# Altium schematic sheet STM32 FillLab WalkThrough.SchDoc
size 420 x 297 mm; SheetNumber: 1; SheetTotal: 1
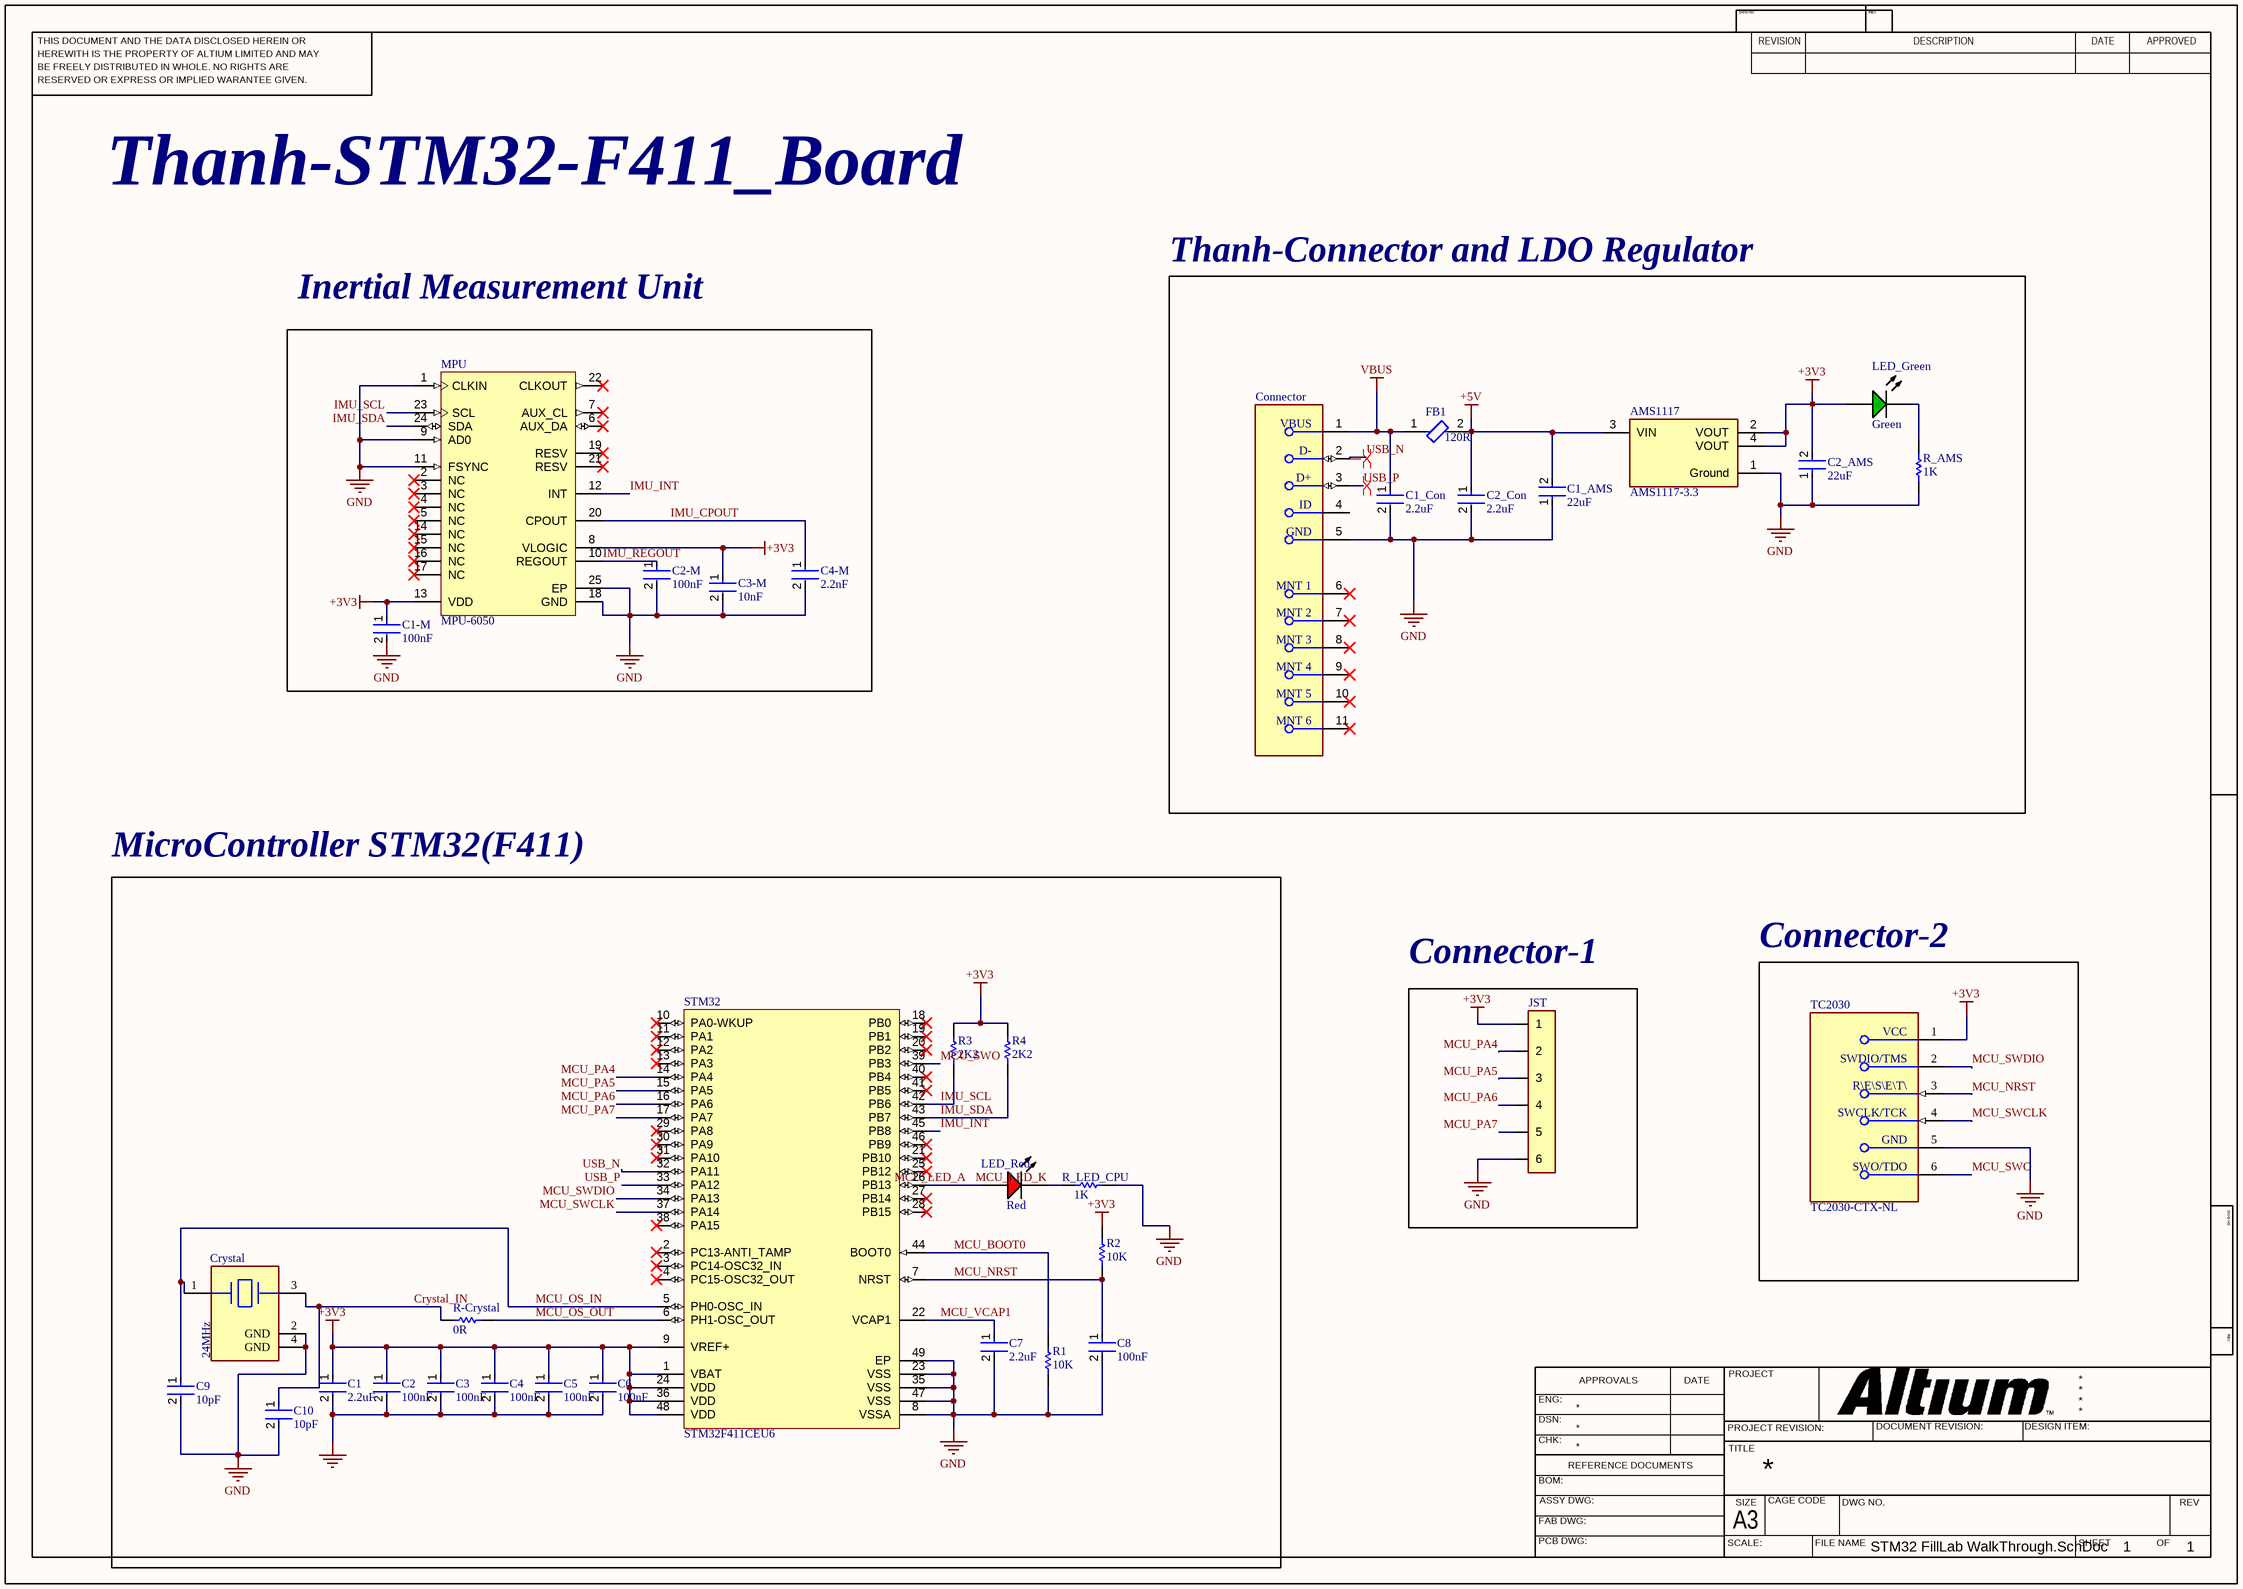
[diagram p0: STM32 FillLab WalkThrough.SchDoc]

## Parts
AMS1117  AMS1117-3.3  [FP-AMS1117-IPC_C]
C1  2.2uF  [FP-C0402-BB-MFG]
C1-M  100nF  [FP-C0402-BB-MFG]
C1_AMS  22uF  [FP-C0402-BB-MFG]
C1_Con  2.2uF  [FP-C0402-BB-MFG]
C2  100nF  [FP-C0402-BB-MFG]
C2-M  100nF  [FP-C0402-BB-MFG]
C2_AMS  22uF  [FP-C0402-BB-MFG]
C2_Con  2.2uF  [FP-C0402-BB-MFG]
C3  100nF  [FP-C0402-BB-MFG]
C3-M  10nF  [FP-C0402-BB-MFG]
C4  100nF  [FP-C0402-BB-MFG]
C4-M  2.2nF  [FP-C0402-BB-MFG]
C5  100nF  [FP-C0402-BB-MFG]
C6  100nF  [FP-C0402-BB-MFG]
C7  2.2uF  [FP-C0402-BB-MFG]
C8  100nF  [FP-C0402-BB-MFG]
C9  10pF  [FP-C0402-BB-MFG]
C10  10pF  [FP-C0402-BB-MFG]
Connector  473460001  [FP-473460001-MFG]  (value not drawn)
Crystal  24MHz  [FP-ABM8-MFG]
FB1  120R  [FP-BLM15-0_05-IPC_B]
JST  SM06B-GHS-TB  [JST-GH-6]  (value not drawn)
LED_Green  Green  [AVAG-HSMX-C170_V]
LED_Red  Red  [AVAG-HSMX-C150_V]
MPU  MPU-6050  [IS-QFN-24_V]
R1  10K  [RESC1609X50X30NL8T20]
R2  10K  [RESC1609X50X30NL8T20]
R3  2K2  [RESC1609X50X30NL8T20]
R4  2K2  [RESC1609X50X30NL8T20]
R-Crystal  0R  [RESC1609X50X30NL8T20]
R_AMS  1K  [RESC1609X50X30NL8T20]
R_LED_CPU  1K  [RESC1609X50X30NL8T20]
STM32  STM32F411CEU6  [STM-UFQFPN48_L]
TC2030  TC2030-CTX-NL  [FP-TC2030-CTX-NL-MFG]

## Blocks framed on the sheet
Thanh-Connector and LDO Regulator: AMS1117 C1_AMS C1_Con C2_AMS C2_Con Connector FB1 LED_Green R_AMS
MicroController STM32(F411): C1-C10 Crystal LED_Red R1-R4 R-Crystal R_LED_CPU STM32
Connector-2: TC2030
Connector-1: JST

## Nets
+3V3: AMS1117.2(VOUT) AMS1117.4(VOUT) C1.1 C1-M.1 C2.1 C2_AMS.2 C3.1 C3-M.1 C4.1 C5.1 C6.1 JST.P$1(1) LED_Green.1(A) MPU.8(VLOGIC) MPU.13(VDD) R2.2 R3.2 R4.2 STM32.1(VBAT) STM32.9(VREF+) STM32.24(VDD) STM32.36(VDD) STM32.48(VDD) TC2030.1(VCC)
+5V: AMS1117.3(VIN) C1_AMS.2 C2_Con.1 FB1.2
GND: AMS1117.1(Ground) C1.2 C1-M.2 C1_AMS.1 C1_Con.2 C2.2 C2-M.2 C2_AMS.1 C2_Con.2 C3.2 C3-M.2 C4.2 C4-M.2 C5.2 C6.2 C7.2 C8.2 C9.2 C10.2 Connector.5(GND) Crystal.2(GND) Crystal.4(GND) JST.P$6(6) MPU.1(CLKIN) MPU.9(AD0) MPU.11(FSYNC) MPU.18(GND) MPU.25(EP) R1.1 R_AMS.1 R_LED_CPU.1 STM32.8(VSSA) STM32.23(VSS) STM32.35(VSS) STM32.47(VSS) STM32.49(EP) TC2030.5(GND)
VBUS: C1_Con.1 Connector.1(VBUS) FB1.1
Crystal_IN: C10.1 Crystal.3 R-Crystal.2
IMU_CPOUT: C4-M.1 MPU.20(CPOUT)
IMU_INT: MPU.12(INT) STM32.45(PB8)
IMU_REGOUT: C2-M.1 MPU.10(REGOUT)
IMU_SCL: MPU.23(SCL) R3.1 STM32.42(PB6)
IMU_SDA: MPU.24(SDA) R4.1 STM32.43(PB7)
MCU_BOOT0: R1.2 STM32.44(BOOT0)
MCU_LED_A: LED_Red.1(A) STM32.26(PB13)
MCU_LED_K: LED_Red.2(K) R_LED_CPU.2
MCU_NRST: C8.1 R2.1 STM32.7(NRST) TC2030.3(~{RESET})
MCU_OS_IN: C9.1 Crystal.1 STM32.5(PH0-OSC_IN)
MCU_OS_OUT: R-Crystal.1 STM32.6(PH1-OSC_OUT)
MCU_PA4: JST.P$2(2) STM32.14(PA4)
MCU_PA5: JST.P$3(3) STM32.15(PA5)
MCU_PA6: JST.P$4(4) STM32.16(PA6)
MCU_PA7: JST.P$5(5) STM32.17(PA7)
MCU_SWCLK: STM32.37(PA14) TC2030.4(SWCLK/TCK)
MCU_SWDIO: STM32.34(PA13) TC2030.2(SWDIO/TMS)
MCU_SWO: STM32.39(PB3) TC2030.6(SWO/TDO)
MCU_VCAP1: C7.1 STM32.22(VCAP1)
USB_N: Connector.2(D-) STM32.32(PA11)
USB_P: Connector.3(D+) STM32.33(PA12)
NetLED_Green_2: LED_Green.2(K) R_AMS.2

Not connected (* = marked no-connect by the designer): Connector 4(ID) 6(MNT_1)* 7(MNT_2)* 8(MNT_3)* 9(MNT_4)* 10(MNT_5)* 11(MNT_6)*; MPU 2(NC)* 3(NC)* 4(NC)* 5(NC)* 6(AUX_DA)* 7(AUX_CL)* 14(NC)* 15(NC)* 16(NC)* 17(NC)* 19(RESV)* 21(RESV)* 22(CLKOUT)*; STM32 2(PC13-ANTI_TAMP)* 3(PC14-OSC32_IN)* 4(PC15-OSC32_OUT)* 10(PA0-WKUP)* 11(PA1)* 12(PA2)* 13(PA3)* 18(PB0)* 19(PB1)* 20(PB2)* 21(PB10)* 25(PB12)* 27(PB14)* 28(PB15)* 29(PA8)* 30(PA9)* 31(PA10)* 38(PA15)* 40(PB4)* 41(PB5)* 46(PB9)*

## Layout directives
differential pair: USB_N, USB_P

## Notes on the sheet
- Thanh-STM32-F411_Board
- Inertial Measurement Unit
- THIS DOCUMENT AND THE DATA DISCLOSED HEREIN OR
- HEREWITH IS THE PROPERTY OF ALTIUM LIMITED AND MAY
- DWG NO:
- REVISION
- REV:
- DESCRIPTION
- DATE
- APPROVED
- BE FREELY DISTRIBUTED IN WHOLE. NO RIGHTS ARE
- RESERVED OR EXPRESS OR IMPLIED WARANTEE GIVEN.
- ENG:
- APPROVALS
- PROJECT
- DSN:
- CHK:
- REFERENCE DOCUMENTS
- PROJECT REVISION:
- TITLE
- DOCUMENT REVISION:
- DESIGN ITEM:
- BOM:
- FAB DWG:
- PCB DWG:
- ASSY DWG:
- SCALE:
- A3
- SIZE
- CAGE CODE
- FILE NAME
- DWG NO.
- SHEET
- OF
- REV

## Library data of the parts
AMS1117 = CMP-209535-000001-1: LDO Voltage Regulators 1A, 3.3V; Manufacturer: Advanced Monolithic Systems; Dropout Voltage: 1.1V; Output Type: Fixed; Nominal Supply Current: 5mA; Max Power Dissipation: 1.2W; Max Supply Voltage: 15V; Number Of Outputs: 1; Standoff Height: 0.64mm; Max Junction Temp: +125°C; Height: 1.8mm; Package: AMS1117; Device Class L2: Power Management ICs; ComponentLink2Description: Datasheet; ComponentLink2URL: http://www.advanced-monolithic.com/pdf/ds1117.pdf; Category: IC; RoHS: TRUE; Automotive: No; Device Class L1: Integrated Circuits (ICs); Output Current: 1A; Device Class L3: Voltage Regulators - Linear; Temperature: -40°C to +125°C; Output Voltage: 3.3V; Manufacturer Part Number: AMS1117-3.3; Temperature Range Low: -40°C; Octopart: https://octopart.com/ams1117-3.3-advanced+monolithic+systems-25899300; Lead Free: Yes; Ipc Land Pattern Name: SOT229P700X180-4; Temperature Range High: +125°C
C1 C1-M C1_AMS C1_Con C2 C2-M C2_AMS C2_Con C3 C3-M C4 C4-M C5-C10 = CMP-2008-02046-2: CAP CER 0.1UF 10V X5R 0402; Manufacturer: Kemet; Manufacturer Part Number: C0402C104K8PACTU; Material: Ceramic; Capacitance: 0.10 μF; Temperature Coefficient: 15%; Tolerance: 0.1; Value: 0.10 μF; Package: C0402-BB; Temperature: -55°C to +125°C; ComponentLink2Description: Datasheet; Temperature Characteristic: X5R; Device Class L1: Passive Components; Height: 0.55mm; Lead Free: Yes; ComponentLink2URL: https://content.kemet.com/datasheets/KEM_C1002_X7R_SMD.pdf; Device Class L2: Capacitors; Temperature Range Low: -55°C; Temperature Range High: +125°C; RoHS: TRUE; Octopart: https://octopart.com/c0402c104k8pactu-kemet-140039; Automotive: No; Mouser Description: Capacitor 100 nF 10 VDC 0402; Category: Cap; Voltage Rating: 10 V; Digikey Description: CAP CER 0.1UF 10V X5R 0402; Ipc Land Pattern Name: CAPC10050X50; Device Class L3: Ceramic Capacitors
Connector = CMP-2000-05246-2: CONN RCPT USB2.0 MICRO B SMD R/A; Manufacturer: Molex; Conn Orientation: Right Angle; Is Female: yes; Shielding: true; Pitch: 0.65mm; Number Of Contacts: 5; Voltage Rating: 30V; Current Rating: 1.8A; Device Class L2: USB Connectors; Digikey Description: CONN RCPT USB2.0 MICRO B SMD R/A; Height: 2.945mm; RoHS: TRUE; ComponentLink2Description: Datasheet; Octopart: https://octopart.com/47346-0001-molex-7164928; Automotive: No; Package: 0; Category: Conn; Device Class L1: Connectors; Usb Standard: USB 2.0; Temperature: -30°C to +85°C; Temperature Range Low: -30°C; Footprint Url: https://www.molex.com/pdm_docs/sd/473460001_sd.pdf; ComponentLink2URL: https://www.molex.com/webdocs/datasheets/pdf/en-us/0473460001_IO_CONNECTORS.pdf; Lead Free: Yes; Manufacturer Part Number: 473460001; Contact Material: Gold,Nickel; Temperature Range High: +85°C; Device Class L3: unset
Crystal = CMP-27762-000036-1: Crystal 24MHz ±20ppm 18pF SMD-4 3.2mm x 2.5mm; ESR (Equivalent Series Resistance): 50R; Frequency Stability: 50ppm; Min Operating Temperature: -20°C; Width: 2.5mm; Series Resistance: 50R; Frequency Tolerance: 20ppm; Tolerance: 20ppm; Load Capacitance: 18pF; Mount: Surface Mount; Height: 0.031inch; RoHS Compliant: Yes; Frequency: 24MHz; Radiation Hardening: No; Packaging: Tape and Reel; Lead Free: Lead Free; Resistor Type: Ceramic; Series: ABM8; Termination: SMD/SMT; Length: 3.2mm; Max Operating Temperature: 70°C; Case/Package: CSMD; Package Quantity: 1000; Depth: 2.5mm; Number of Pins: 4; Operating Frequency: 24 MHz; Accuracy: 20ppm; REACH SVHC: No SVHC
FB1 = CMP-0686-00181-5: Chip Ferrite Bead, 0402, 1000Ω @ 100MHz, 0.65Ω, 25%, 300mA; DC Current: 200mA; Number of Circuits: 1; Shielding: Unshielded; Impedance: 1kR; DC Resistance (DCR): 650mR; DC Resistance-Max: 1R; Packaging: Tape and Reel; Case Code (Imperial): 0402; Military Standard: Not; Min Operating Temperature: -55°C; Width: 0.5mm; Tolerance: 25%; Material: Ferrite; Number of Lines: 1; Max Current Rating: 300mA; Depth: 0.55mm; Package Quantity: 1; Case/Package: 0402; Series: BLM15AG_SN; Case Code (Metric): 1005; Max Operating Temperature: 125°C; Lead Free: Lead Free; Test Frequency: 100MHz; RoHS Compliant: Yes; Radiation Hardening: No; Number of Pins: 2; Core Material: Ferrite; Current Rating: 300mA; Frequency: 100MHz; Max DC Current: 200mA; REACH SVHC: No SVHC; Length: 1mm; Termination: SMD/SMT; Height: 0.5mm
JST = SM06B-GHS-TB: Connector Header Surface Mount, Right Angle 6 position 0.049 (1.25mm); MF: JST Sales; SnapEDA_Link: https://www.snapeda.com/parts/SM06B-GHS-TB/JST+Sales+America+Inc./view-part/?ref=snap; Package: None; Value: *; MP: SM06B-GHS-TB; Check_prices: https://www.snapeda.com/parts/SM06B-GHS-TB/JST+Sales+America+Inc./view-part/?ref=eda
LED_Green = CMP-2000-05062-1: Chip LED, Green, 2.2 V, -40 to 85 degC, 2-Pin SMD, Pb-Free, Tape and Reel; Manufacturer: Avago; No. of Pins: 2; Peak Wavelength: 570nm; SVHC: NoSVHC(16-Jun-2014); Dominant Wavelength: 572nm; Forward Current If: 20mA; Viewing Angle: 170deg; Lens Shape: Rectangular; PIV Max: 5V; External Width: 1.25mm; LED Type: Standard; External Depth: 0.8mm; Opto Mounting Orientation: Top; Luminous Intensity: 15mcd; Luminous Intensity Min: 4mcd; Forward Voltage VF Max: 2.6V; External Length / Height: 2mm; Bulb Size: 1.25mmx1.4mm; Light Area Height: 1mm; Voltage Vf Typ: 2.2V; Operating Temperature Max: 85degC; Datasheet Version: Oct-08; MSL: MSL2A-4weeks; Peak Forward Current: 20mA; Package Description: 2-Pin Surface Mount Device, Body 2 x 1.25 mm, Height 0.8 mm; Datasheet URL: https://datasheet.ciiva.com/29280/180495-da-01-en-chip-led-hsmg-c170-gelb-gruen-29280971.pdf; Storage Temperature Min: -40degC; LED Colour: Green; Wavelength Typ: 570nm; Mounting Type: SMD; Forward Current If Max: 20mA; Dominant Wavelength Typ: 572nm; LED Mounting: SMD; Operating Temperature Range: -30degCto+85degC; Operating Temperature Min: -30degC; Manufacturer URL: http://www.avagotech.com/; Packaging: CutTape; Luminous Intensity Typ: 15mcd; Package Reference: HSMX-C170; Storage Temperature Max: 85degC; Opto Case Style: SMD; Forward Voltage: 2.2V
LED_Red = CMP-2000-06426-1: LED Uni-Color Red, 65 mW, 25 mA, -40 to 85 degC, 2-Pin SMD, RoHS, Tape and Reel; Manufacturer: Avago; Product Height (mm): 1.1mm; Power Dissipation: 78W; Product Length (mm): 3.2mm; Forward Voltage: 2.6V; Luminous Intensity: 17mcd; DELETED: Compliant; Shape Type: Rectangular; Peak Wavelength: 660nm; Main Category: ChipLED; Dominant Wave Length: 639nm; Rad Hardened: No; Lens Type: ColorlessDiffused; Product Depth (mm): 1.6mm; Reverse Voltage: 5V; Forward Current: 25mA; Chip Material: GaAlAs; Test Current (It): 20mA; Viewing Angle: 170deg; Number of  Elements: 1; Type: Uni-Color; Package Reference: HSMX-C150; Package Description: 2-Pin Surface Mount Device, Body 3.2 x 1.6 mm; Operating Temp Range: -40Cto85C; Mounting: SurfaceMount; Emitting Color: Red; Pin Count: 2; Operating Temperature Classification: Industrial; Datasheet URL: http://media.digikey.com/pdf/Data%20Sheets/Avago%20PDFs/HSMz-Czzz.pdf; Package Type: ChipLed; Mounting Technology: SurfaceMount; High Brightness: No; Lens Dimensions: 2x1.6x0.6mm; Manufacturer URL: http://www.avagotech.com/; Lum Intensity: 17mcd; Datasheet Version: 03/2012; Packaging: TapeandReel
MPU = CMP-1753-00002-2: 3-Axis Gyroscope, Accelerometer and a Digital Motion Processor(TM) (DMP), 2.375 to 3.46 V, -40 to 85 degC, 24-Pin QFN, RoHS, Tape and Reel; Manufacturer: InvenSense; Featured Product: MPU-60506-Axis,IntegratedI²CSolution; Other Names: 1428-1007-2 / MPU6050; Sensor Type: MotionTracking; Online Catalog: MPU-6000™Series; Unit PriceUSD: Digital; Datasheet Version: Rev. 3.3, 05/2012; Category: Sensors,Transducers; Datasheet URL: http://datasheet.octopart.com/MPU-6050-InvenSense-datasheet-14421344.pdf; Family: Multifunction; Standard Package: 5,000; Manufacturer URL: http://www.invensense.com/; Output Type: Digital; Dynamic Catalog: MPU-6000™Series
R1-R4 R-Crystal R_AMS R_LED_CPU = CMP-1666-00005-4: Chip Resistor, 10 KOhm, +/- 1%, 100 mW, -55 to 155 degC, 0603 (1608 Metric), RoHS, Tape and Reel; Manufacturer: Vishay Semiconductor; Voltage Rating: 75 V; Max Operating Temperature: 155 degC; PackageDescription: 2-Pin Surface Mount Device, Body 1.575 x 0.85 mm; ComponentLink1Description: Manufacturer URL; RoHSCompliant: true; PackageReference: 0603; REACH SVHC: Unknown; Length: 1.55 mm; DatasheetVersion: 06/2012; Packaging: Tape and Reel; Min Operating Temperature: -55 degC; Mounting Technology: Surface Mount; ComponentLink2URL: https://datasheet.ciiva.com/11809/0900766b80d98afc-11809037.pdf; Height: 0.45 mm; ComponentLink2Description: Datasheet; Package Quantity: 5000; ComponentLink1URL: http://www.vishay.com/
STM32 = CMP-0243-00165-1: ARM Cortex-M4 32-bit MCU+FPU, 512 KB Flash, 128 KB RAM, 36 I/Os, 48-Pin UFQFPN, -40 to 85 degC, Tray; Operating Frequency(F) (Processor speed) (MHz): 100; FLASH Size (Prog) (kB): 512; Internal RAM Size (kB): 128; I/Os (High Current): 36; Supply Voltage(Vcc) min (V): 1.7; Package Reference: 48-Pin Ultra Thin Fine Pitch Quad Flat No-Lead, 7 x 7 x 0.6 mm Body, 0.5 mm Pitch, Exposed Pad; ComponentLink1Description: Manufacturer URL; ComponentLink1URL: http://www.st.com/; Packing: Tray; Package Description: UFQFPN48; Core: ARM Cortex-M4; ComponentLink2Description: Datasheet; ComponentLink2URL: http://www.st.com/st-web-ui/static/active/en/resource/technical/document/datasheet/DM00115249.pdf; DatasheetVersion: Rev. 6; Mounting Technology: Surface Mount
TC2030 = CMP-205963-000001-1: 6-Pin “No legs” TC2030 Plug-of-Nails™ Cable for use with ARM Cortex processors